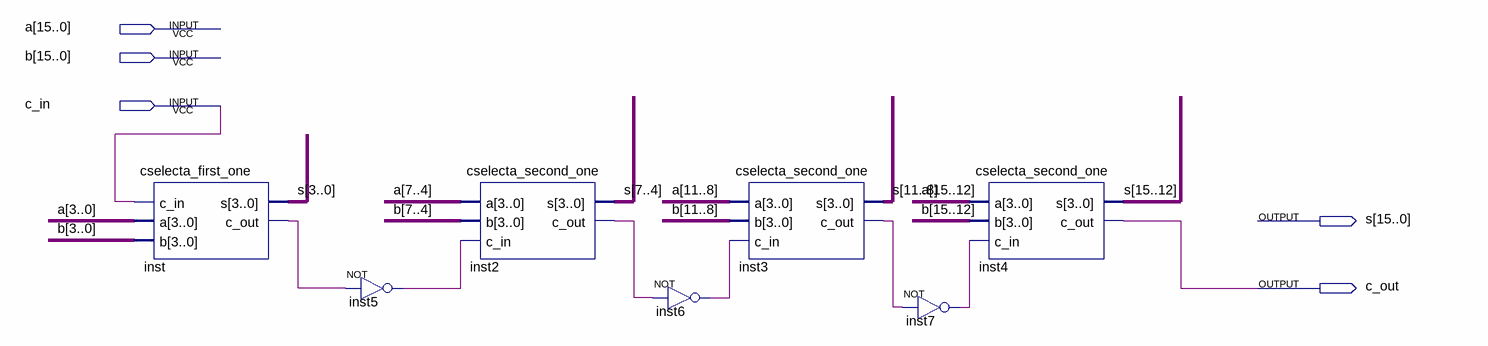
[diagram p0: schematic sheet]
// Quartus schematic Carry_Select_Adder_Uniform.bdf as structural Verilog: 7 symbols, 5 pins
module Carry_Select_Adder_Uniform (
  input  [15:0] a,
  input  [15:0] b,
  input  c_in,
  output [15:0] s,
  output c_out
);

  wire inst2_c_out, inst3_c_out, inst5_out, inst6_out, inst7_out, inst_c_out;

  cselecta_first_one inst (.c_in(c_in), .a(a[3:0]), .b(b[3:0]), .s(s[3:0]), .c_out(inst_c_out));
  not inst5 (inst5_out, inst_c_out);
  cselecta_second_one inst2 (.a(a[7:4]), .b(b[7:4]), .c_in(inst5_out), .s(s[7:4]), .c_out(inst2_c_out));
  not inst6 (inst6_out, inst2_c_out);
  cselecta_second_one inst3 (.a(a[11:8]), .b(b[11:8]), .c_in(inst6_out), .s(s[11:8]), .c_out(inst3_c_out));
  not inst7 (inst7_out, inst3_c_out);
  cselecta_second_one inst4 (.a(a[15:12]), .b(b[15:12]), .c_in(inst7_out), .s(s[15:12]), .c_out(c_out));
endmodule
